# EAGLE schematic Sequencer - 8 Step - Cigar Box (EAGLE 6.6.0)

## Sheet 1 of 9: Power
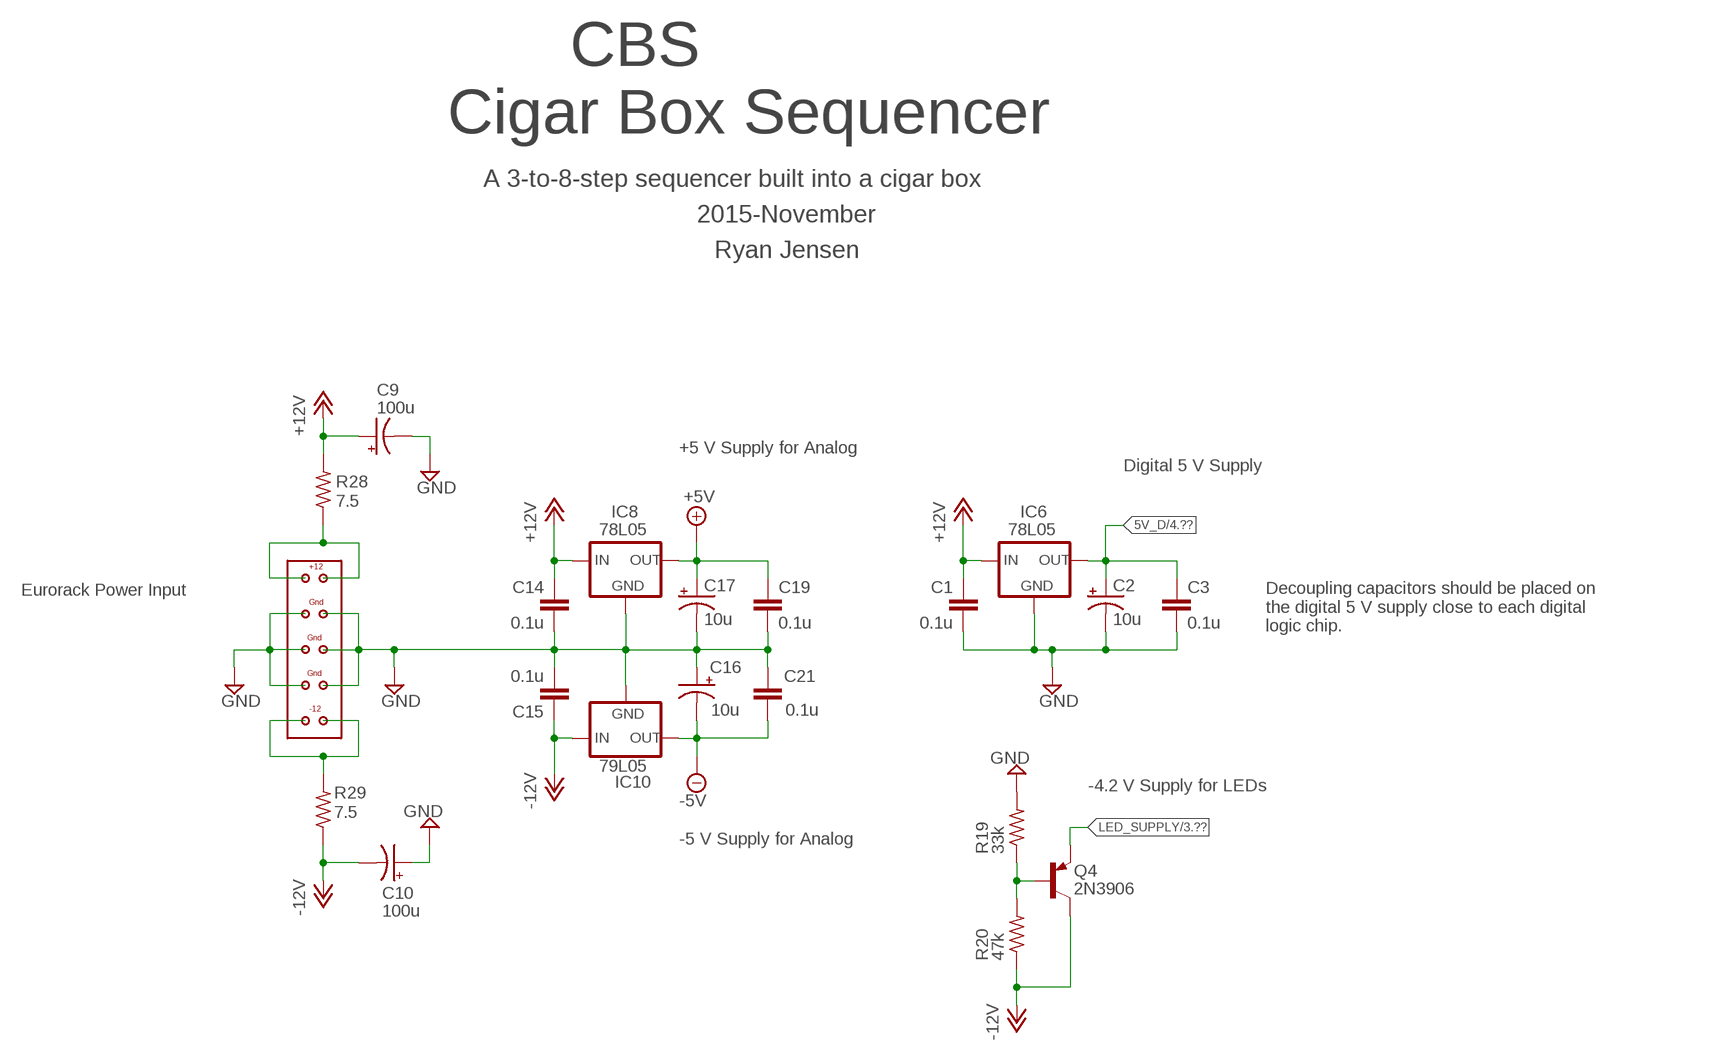
[diagram p0: schematic, sheet 1]

### Parts
C1  0.1u  C-EU025-050X050  [C025-050X050]
C2  10u  CPOL-USE3.5-10  [E3,5-10]
C3  0.1u  C-EU025-050X050  [C025-050X050]
C9  100u  CPOL-USE3.5-10  [E3,5-10]
C10  100u  CPOL-USE3.5-10  [E3,5-10]
C14  0.1u  C-EU025-050X050  [C025-050X050]
C15  0.1u  C-EU025-050X050  [C025-050X050]
C16  10u  CPOL-USE3.5-10  [E3,5-10]
C17  10u  CPOL-USE3.5-10  [E3,5-10]
C19  0.1u  C-EU025-050X050  [C025-050X050]
C21  0.1u  C-EU025-050X050  [C025-050X050]
IC6  78L05  78LXX  [78LXX]
IC8  78L05  78LXX  [78LXX]
IC10  79L05  79LXX  [79LXX]
Q4  2N3906  [TO92]
R19  33k  R-US_R0603  [R0603]
R20  47k  R-US_R0603  [R0603]
R28  7.5  R-US_0204/7  [0204/7]
R29  7.5  R-US_0204/7  [0204/7]
U$10  EURORACK-POWER  [EURORACK-POWER]

### Nets
5V_D: C2.+ C3.1 IC6.OUT ; also sheet 4,5,6
+5V: C17.+ C19.1 IC8.OUT ; also sheet 3,7
+12V: C1.1 C9.+ C14.1 IC6.IN IC8.IN R28.2 ; also sheet 2,7
-5V: C16.- C21.2 IC10.OUT ; also sheet 3,7
-12V: C10.- C15.1 IC10.IN Q4.1(C) R20.1 R29.1
GND: C1.2 C2.- C3.2 C9.- C10.+ C14.2 C15.2 C16.+ C17.- C19.2 C21.1 IC6.GND IC8.GND IC10.GND R19.2 U$10.P$3 U$10.P$4 U$10.P$5 U$10.P$6 U$10.P$7 U$10.P$8 ; also sheet 2,3,4,5,6,7,8,9
LED_SUPPLY: Q4.3(E) ; also sheet 3,8
N$36: R28.1 U$10.P$1 U$10.P$2
N$37: R29.2 U$10.P$9 U$10.P$10
N$41: Q4.2(B) R19.1 R20.2

### Notes on the sheet
- CBS
  Cigar Box Sequencer
- A 3-to-8-step sequencer built into a cigar box
- 2015-November
- Ryan Jensen
- +5 V Supply for Analog
- Digital 5 V Supply
- Eurorack Power Input
- Decoupling capacitors should be placed on
  the digital 5 V supply close to each digital
  logic chip.
- -4.2 V Supply for LEDs
- -5 V Supply for Analog

## Sheet 2 of 9: Rotary Switch 7-Segment LED control and reset signal routing
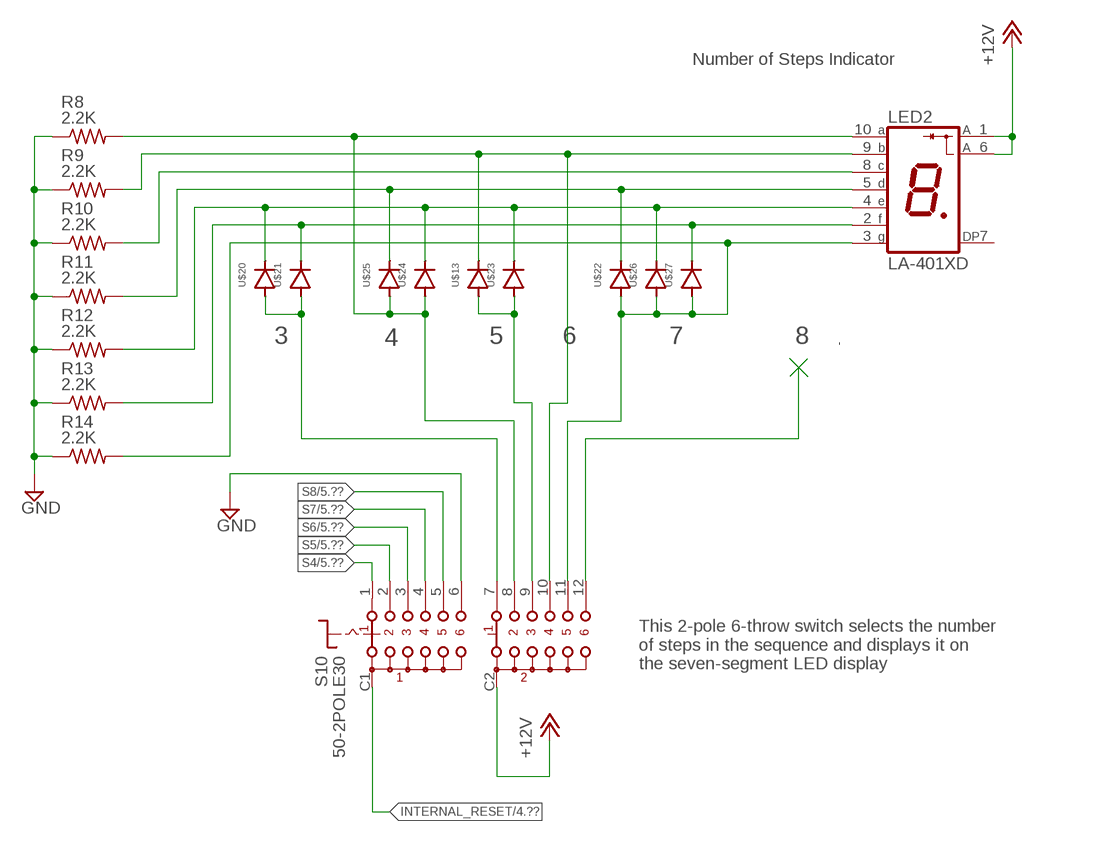
[diagram p1: schematic, sheet 2]

### Parts
LED2  LA-401XD  [LA-401]
R8  2.2K  R-US_R0603  [R0603]
R9  2.2K  R-US_R0603  [R0603]
R10  2.2K  R-US_R0603  [R0603]
R11  2.2K  R-US_R0603  [R0603]
R12  2.2K  R-US_R0603  [R0603]
R13  2.2K  R-US_R0603  [R0603]
R14  2.2K  R-US_R0603  [R0603]
S10  50-2POLE30  [50-2POLE30]
U$13  DIODE-0204/5  [DIODE-0204/5]
U$20  DIODE-0204/5  [DIODE-0204/5]
U$21  DIODE-0204/5  [DIODE-0204/5]
U$22  DIODE-0204/5  [DIODE-0204/5]
U$23  DIODE-0204/5  [DIODE-0204/5]
U$24  DIODE-0204/5  [DIODE-0204/5]
U$25  DIODE-0204/5  [DIODE-0204/5]
U$26  DIODE-0204/5  [DIODE-0204/5]
U$27  DIODE-0204/5  [DIODE-0204/5]

### Nets
+12V: LED2.1(A) LED2.6(A) S10.C2(S2) ; also sheet 1,7
GND: R8.1 R9.1 R10.1 R11.1 R12.1 R13.1 R14.1 S10.6 ; also sheet 1,3,4,5,6,7,8,9
INTERNAL_RESET: S10.C1(S1) ; also sheet 4
N$13: LED2.9(B) R9.2 S10.10 U$13.CATHODE
N$14: LED2.8(C) R10.2
N$15: LED2.5(D) R11.2 U$22.CATHODE U$25.CATHODE
N$16: LED2.4(E) R12.2 U$20.CATHODE U$23.CATHODE U$24.CATHODE U$26.CATHODE
N$17: LED2.2(F) R13.2 U$21.CATHODE U$27.CATHODE
N$18: S10.7 U$20.ANODE U$21.ANODE
N$19: LED2.10(A) R8.2 S10.8 U$24.ANODE U$25.ANODE
N$20: S10.9 U$13.ANODE U$23.ANODE
N$21: LED2.3(G) R14.2 S10.11 U$22.ANODE U$26.ANODE U$27.ANODE
N$22: S10.12
S4: S10.1 ; also sheet 5,7,9
S5: S10.2 ; also sheet 5,7,9
S6: S10.3 ; also sheet 5,7,9
S7: S10.4 ; also sheet 5,7,9
S8: S10.5 ; also sheet 5,7,9
Unconnected: LED2.7(DP)

### Notes on the sheet
- Number of Steps Indicator
- 3 | 4 | 5 | 6 | 7 | 8
- This 2-pole 6-throw switch selects the number
  of steps in the sequence and displays it on
  the seven-segment LED display

## Sheet 3 of 9: Clock Internal VCO, External Clock, Clock Combination
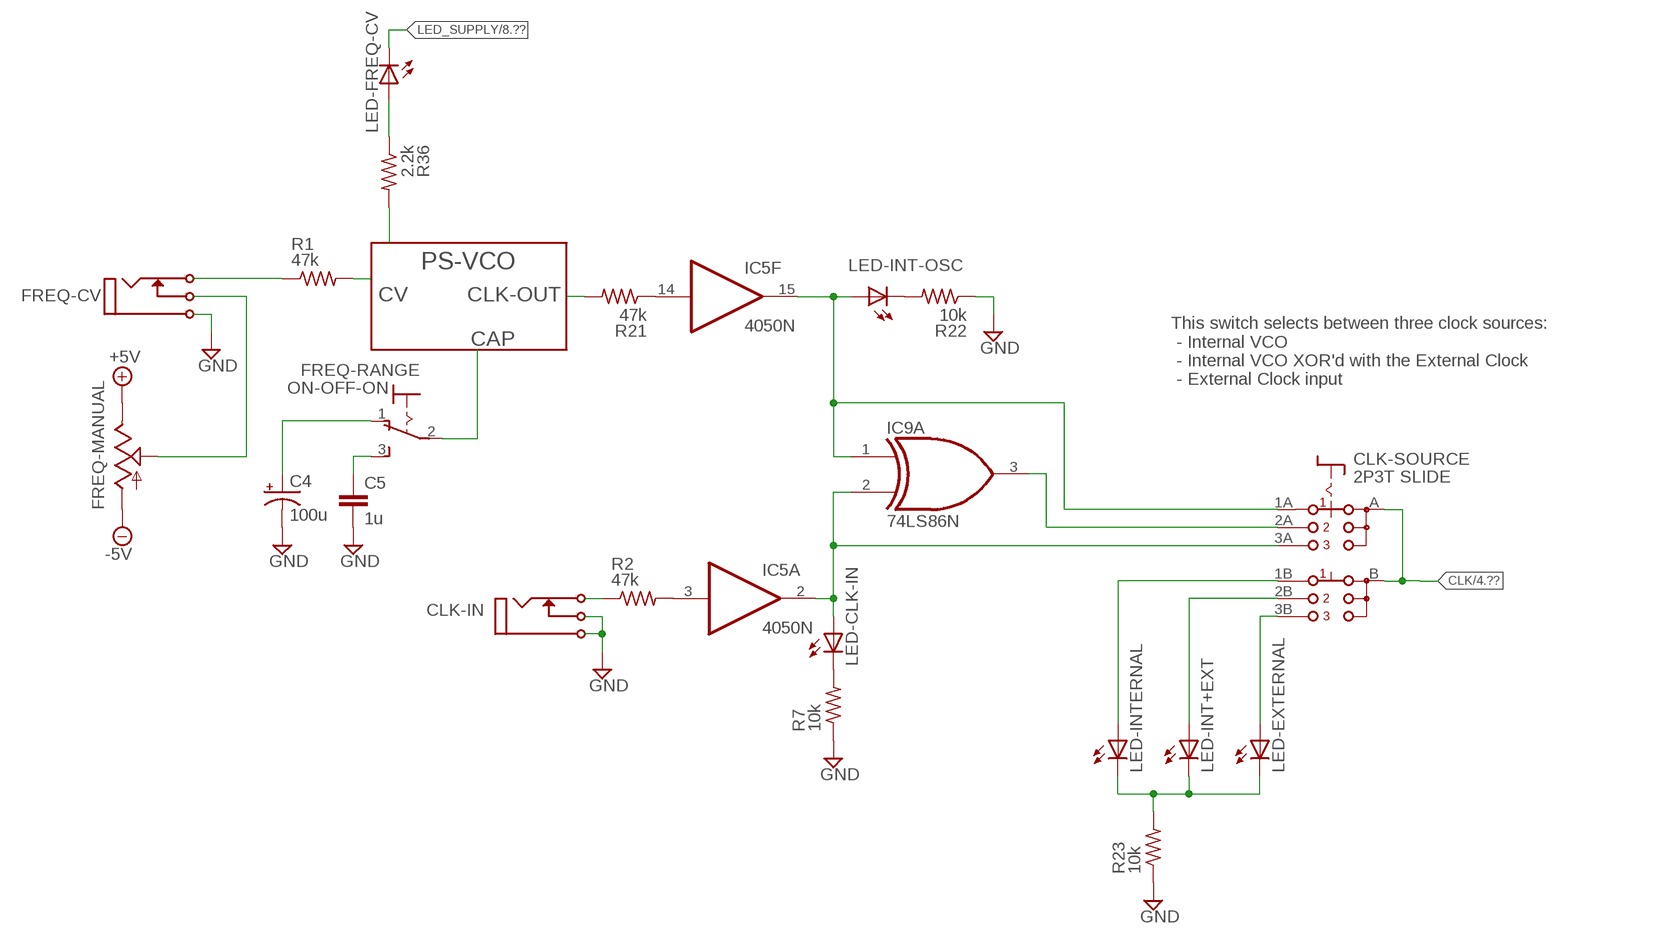
[diagram p2: schematic, sheet 3]

### Parts
C4  100u  CPOL-USE3.5-10  [E3,5-10]
C5  1u  C-EU025-050X050  [C025-050X050]
CLK-IN  I/O  MONO_JACK  [MONO_JACK]
CLK-SOURCE  2P3T SLIDE  ELMA-01-2X3  [ELMA-01-2X3]
FREQ-CV  I/O  MONO_JACK  [MONO_JACK]
FREQ-MANUAL  TRIM_US-B64Y  [B64Y]
FREQ-RANGE  ON-OFF-ON  320-916  [320-916]
IC5  4050N  [DIL16]
IC9  74LS86N  [DIL14]
LED-CLK-IN  TLLG4400  [LED3MM]
LED-EXTERNAL  TLLG4400  [LED3MM]
LED-FREQ-CV  TLLG4400  [LED3MM]
LED-INT+EXT  TLLG4400  [LED3MM]
LED-INT-OSC  TLLG4400  [LED3MM]
LED-INTERNAL  TLLG4400  [LED3MM]
R1  47k  R-US_R0603  [R0603]
R2  47k  R-US_R0603  [R0603]
R7  10k  R-US_R0603  [R0603]
R21  47k  R-US_R0603  [R0603]
R22  10k  R-US_R0603  [R0603]
R23  10k  R-US_R0603  [R0603]
R36  2.2k  R-US_R0603  [R0603]

### Nets
+5V: FREQ-MANUAL.E ; also sheet 1,7
-5V: FREQ-MANUAL.A ; also sheet 1,7
GND: C4.- C5.2 CLK-IN.P$1 CLK-IN.P$3(P3) FREQ-CV.P$1 R7.1 R22.1 R23.1 ; also sheet 1,2,4,5,6,7,8,9
LED_SUPPLY: LED-FREQ-CV.K(C) ; also sheet 1,8
N$1: R36.2
N$2: FREQ-CV.P$2(P2) R1.1
N$3: R1.2
N$4: IC5.3(A:I) R2.2
N$5: FREQ-CV.P$3(P3) FREQ-MANUAL.S
N$25: CLK-SOURCE.3A(A3) IC5.2(A:O) IC9.2(A:I1) LED-CLK-IN.A
N$26: CLK-IN.P$2(P2) R2.1
N$31: LED-CLK-IN.K(C) R7.2
N$38: FREQ-RANGE.2(P)
N$39: C5.1 FREQ-RANGE.3(S)
N$40: C4.+ FREQ-RANGE.1(O)
N$43: IC5.14(F:I) R21.1
N$44: LED-INT-OSC.K(C) R22.2
N$45: CLK-SOURCE.1A(A1) IC5.15(F:O) IC9.1(A:I0) LED-INT-OSC.A
N$46: CLK-SOURCE.A CLK-SOURCE.B
N$48: CLK-SOURCE.3B(B3) LED-EXTERNAL.A
N$49: CLK-SOURCE.2B(B2) LED-INT+EXT.A
N$50: CLK-SOURCE.1B(B1) LED-INTERNAL.A
N$51: LED-EXTERNAL.K(C) LED-INT+EXT.K(C) LED-INTERNAL.K(C) R23.2
N$54: R21.2
N$57: LED-FREQ-CV.A R36.1
N$70: CLK-SOURCE.2A(A2) IC9.3(A:O)
Unconnected: IC9.8(C:O) IC9.9(C:I0) IC9.10(C:I1)

### Notes on the sheet
- PS-VCO
- CV | CLK-OUT
- CAP
- This switch selects between three clock sources:
   - Internal VCO 
   - Internal VCO XOR'd with the External Clock
   - External Clock input

## Sheet 4 of 9: Binary Counter This part of the circuit contains the binary counter, along with the binary inputs and outputs.
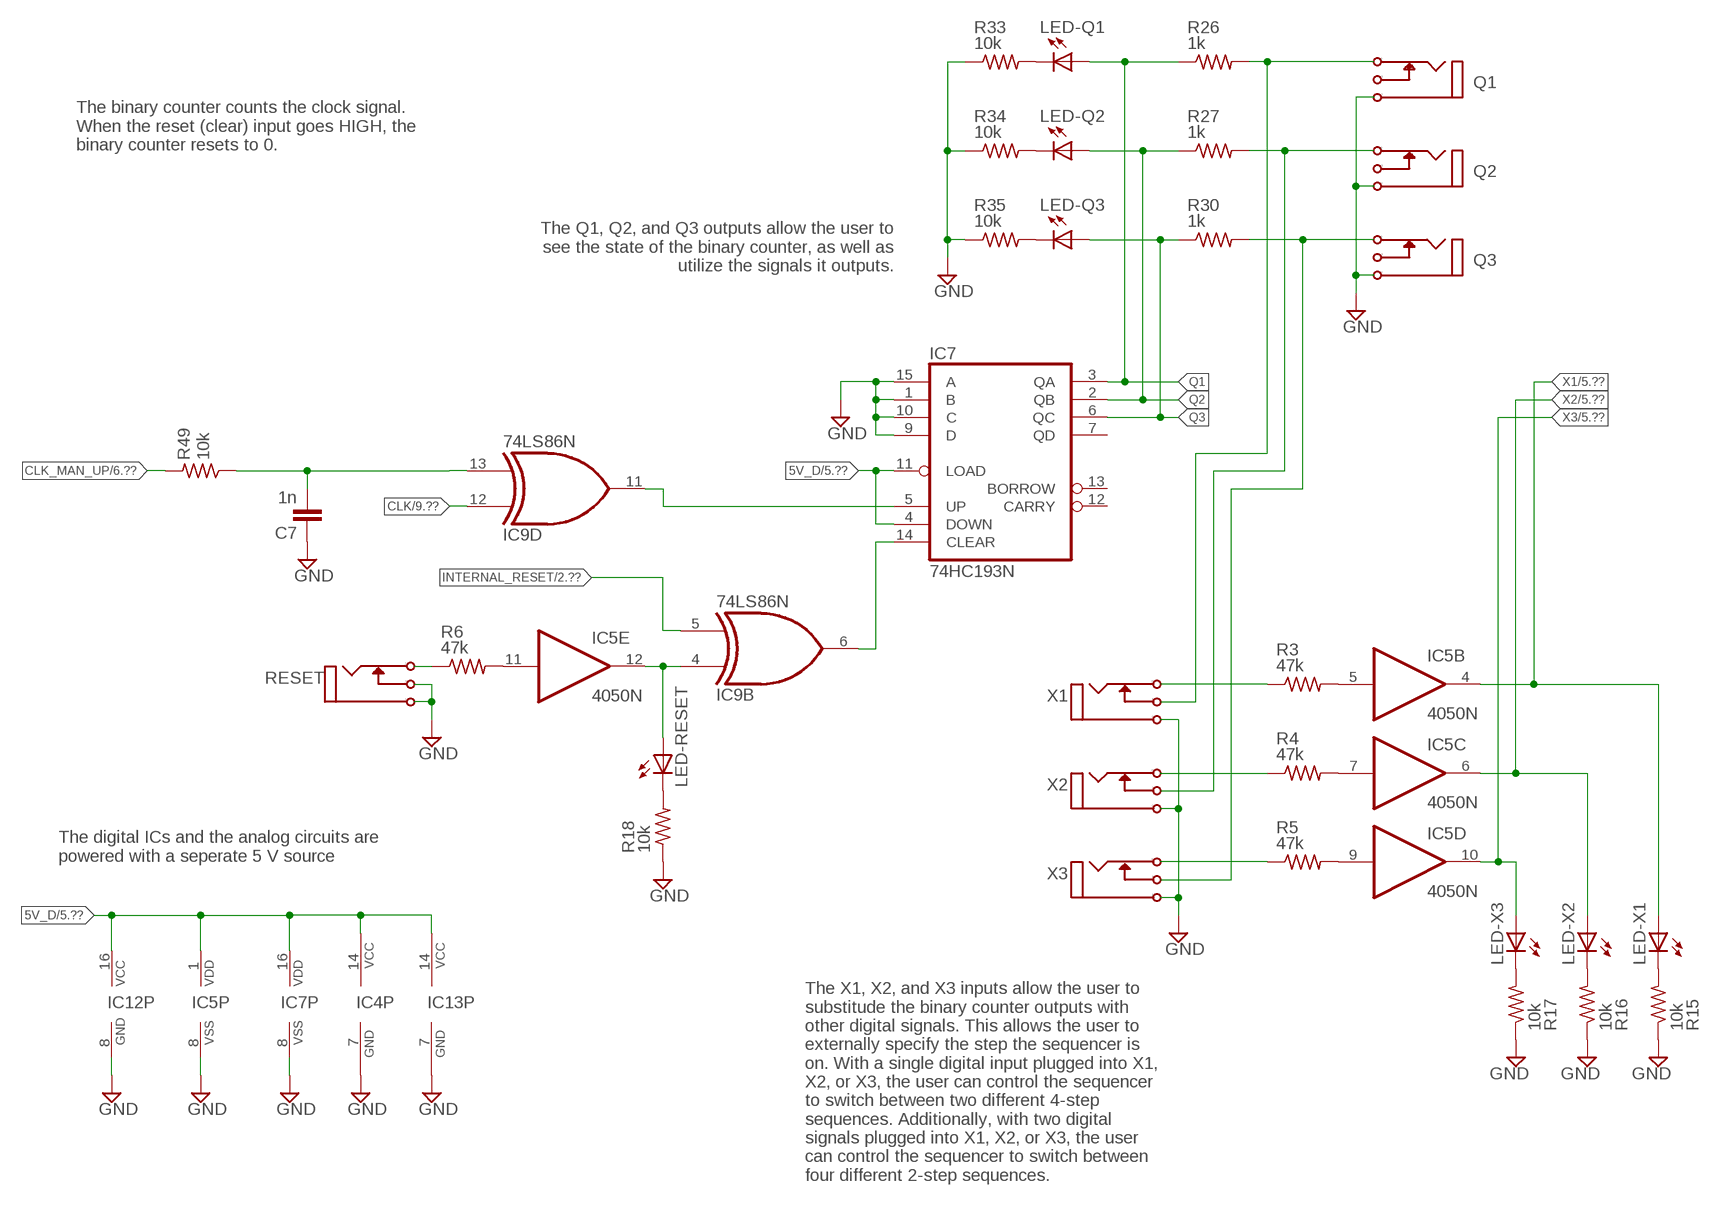
[diagram p3: schematic, sheet 4]

### Parts
C7  1n  C-EU025-050X050  [C025-050X050]
IC4  74ALS04N  [DIL14]
IC7  74HC193N  40193N  [DIL16]
IC12  74AC138N  [DIL16]
IC13  74ALS04N  [DIL14]
LED-Q1  TLLG4400  [LED3MM]
LED-Q2  TLLG4400  [LED3MM]
LED-Q3  TLLG4400  [LED3MM]
LED-RESET  TLLG4400  [LED3MM]
LED-X1  TLLG4400  [LED3MM]
LED-X2  TLLG4400  [LED3MM]
LED-X3  TLLG4400  [LED3MM]
Q1  I/O  MONO_JACK  [MONO_JACK]
Q2  I/O  MONO_JACK  [MONO_JACK]
Q3  I/O  MONO_JACK  [MONO_JACK]
R3  47k  R-US_R0603  [R0603]
R4  47k  R-US_R0603  [R0603]
R5  47k  R-US_R0603  [R0603]
R6  47k  R-US_R0603  [R0603]
R15  10k  R-US_R0603  [R0603]
R16  10k  R-US_R0603  [R0603]
R17  10k  R-US_R0603  [R0603]
R18  10k  R-US_R0603  [R0603]
R26  1k  R-US_R0603  [R0603]
R27  1k  R-US_R0603  [R0603]
R30  1k  R-US_R0603  [R0603]
R33  10k  R-US_R0603  [R0603]
R34  10k  R-US_R0603  [R0603]
R35  10k  R-US_R0603  [R0603]
R49  10k  R-US_0204/7  [0204/7]
RESET  I/O  MONO_JACK  [MONO_JACK]
X1  I/O  MONO_JACK  [MONO_JACK]
X2  I/O  MONO_JACK  [MONO_JACK]
X3  I/O  MONO_JACK  [MONO_JACK]

### Nets
5V_D: IC4.14(P:VCC) IC5.1(P:VDD) IC7.4(DOWN) IC7.11(LOAD) IC7.16(VDD) IC12.16(VCC) IC13.14(P:VCC) ; also sheet 1,5,6
CLK: IC9.12(D:I0) ; also sheet 3,9
CLK_MAN_UP: R49.2 ; also sheet 6
CLK_MAN_UP_FLT: IC9.13(D:I1)
GND: C7.1 IC4.7(P:GND) IC5.8(P:VSS) IC7.1(B) IC7.8(VSS) IC7.9(D) IC7.10(C) IC7.15(A) IC12.8(GND) IC13.7(P:GND) Q1.P$1 Q2.P$1 Q3.P$1 R15.1 R16.1 R17.1 R18.1 R33.1 R34.1 R35.1 RESET.P$1 RESET.P$3(P3) X1.P$1 X2.P$1 X3.P$1 ; also sheet 1,2,3,5,6,7,8,9
INTERNAL_RESET: IC9.5(B:I1) ; also sheet 2
N$6: IC5.5(B:I) R3.2
N$7: IC5.7(C:I) R4.2
N$8: IC5.9(D:I) R5.2
N$9: IC5.11(E:I) R6.2
N$10: IC5.12(E:O) IC9.4(B:I0) LED-RESET.A
N$27: R3.1 X1.P$2(P2)
N$28: R4.1 X2.P$2(P2)
N$29: R5.1 X3.P$2(P2)
N$30: R6.1 RESET.P$2(P2)
N$32: LED-X1.K(C) R15.2
N$33: LED-X2.K(C) R16.2
N$34: LED-X3.K(C) R17.2
N$35: LED-RESET.K(C) R18.2
N$42: IC7.14(CLEAR) IC9.6(B:O)
N$52: Q1.P$2(P2) R26.2 X1.P$3(P3)
N$53: Q2.P$2(P2) R27.2 X2.P$3(P3)
N$55: IC7.5(UP) IC9.11(D:O)
N$62: LED-Q1.K(C) R33.2
N$63: LED-Q2.K(C) R34.2
N$64: LED-Q3.K(C) R35.2
N$74: C7.2 R49.1
N$123: Q3.P$2(P2) R30.2 X3.P$3(P3)
Q1: IC7.3(QA) LED-Q1.A R26.1
Q2: IC7.2(QB) LED-Q2.A R27.1
Q3: IC7.6(QC) LED-Q3.A R30.1
X1: IC5.4(B:O) LED-X1.A ; also sheet 5
X2: IC5.6(C:O) LED-X2.A ; also sheet 5
X3: IC5.10(D:O) LED-X3.A ; also sheet 5
Unconnected: IC4.1(A:I) IC4.2(A:O) IC4.3(B:I) IC4.4(B:O) IC4.5(C:I) IC4.6(C:O) IC4.8(D:O) IC4.9(D:I) IC4.10(E:O) IC4.11(E:I) IC4.12(F:O) IC4.13(F:I) IC7.7(QD) IC7.12(CARRY) IC7.13(BORROW) IC12.1(A) IC12.2(B) IC12.3(C) IC12.4(G2A) IC12.5(G2B) IC12.6(G1) IC12.7(Y7) IC12.9(Y6) IC12.10(Y5) IC12.11(Y4) IC12.12(Y3) IC12.13(Y2) IC12.14(Y1) IC12.15(Y0) IC13.1(A:I) IC13.2(A:O) IC13.3(B:I) IC13.4(B:O) IC13.5(C:I) IC13.6(C:O) IC13.8(D:O) IC13.9(D:I) IC13.10(E:O) IC13.11(E:I) IC13.12(F:O) IC13.13(F:I) Q1.P$3(P3) Q2.P$3(P3) Q3.P$3(P3)

### Notes on the sheet
- The binary counter counts the clock signal.
  When the reset (clear) input goes HIGH, the
  binary counter resets to 0.
- The Q1, Q2, and Q3 outputs allow the user to
  see the state of the binary counter, as well as
  utilize the signals it outputs.
- The digital ICs and the analog circuits are
  powered with a seperate 5 V source
- The X1, X2, and X3 inputs allow the user to
  substitude the binary counter outputs with
  other digital signals. This allows the user to
  externally specify the step the sequencer is
  on. With a single digital input plugged into X1,
  X2, or X3, the user can control the sequencer
  to switch between two different 4-step
  sequences. Additionally, with two digital
  signals plugged into X1, X2, or X3, the user
  can control the sequencer to switch between
  four different 2-step sequences.

## Sheet 5 of 9: Demultiplexer This converts the three binary lines into eight steps.
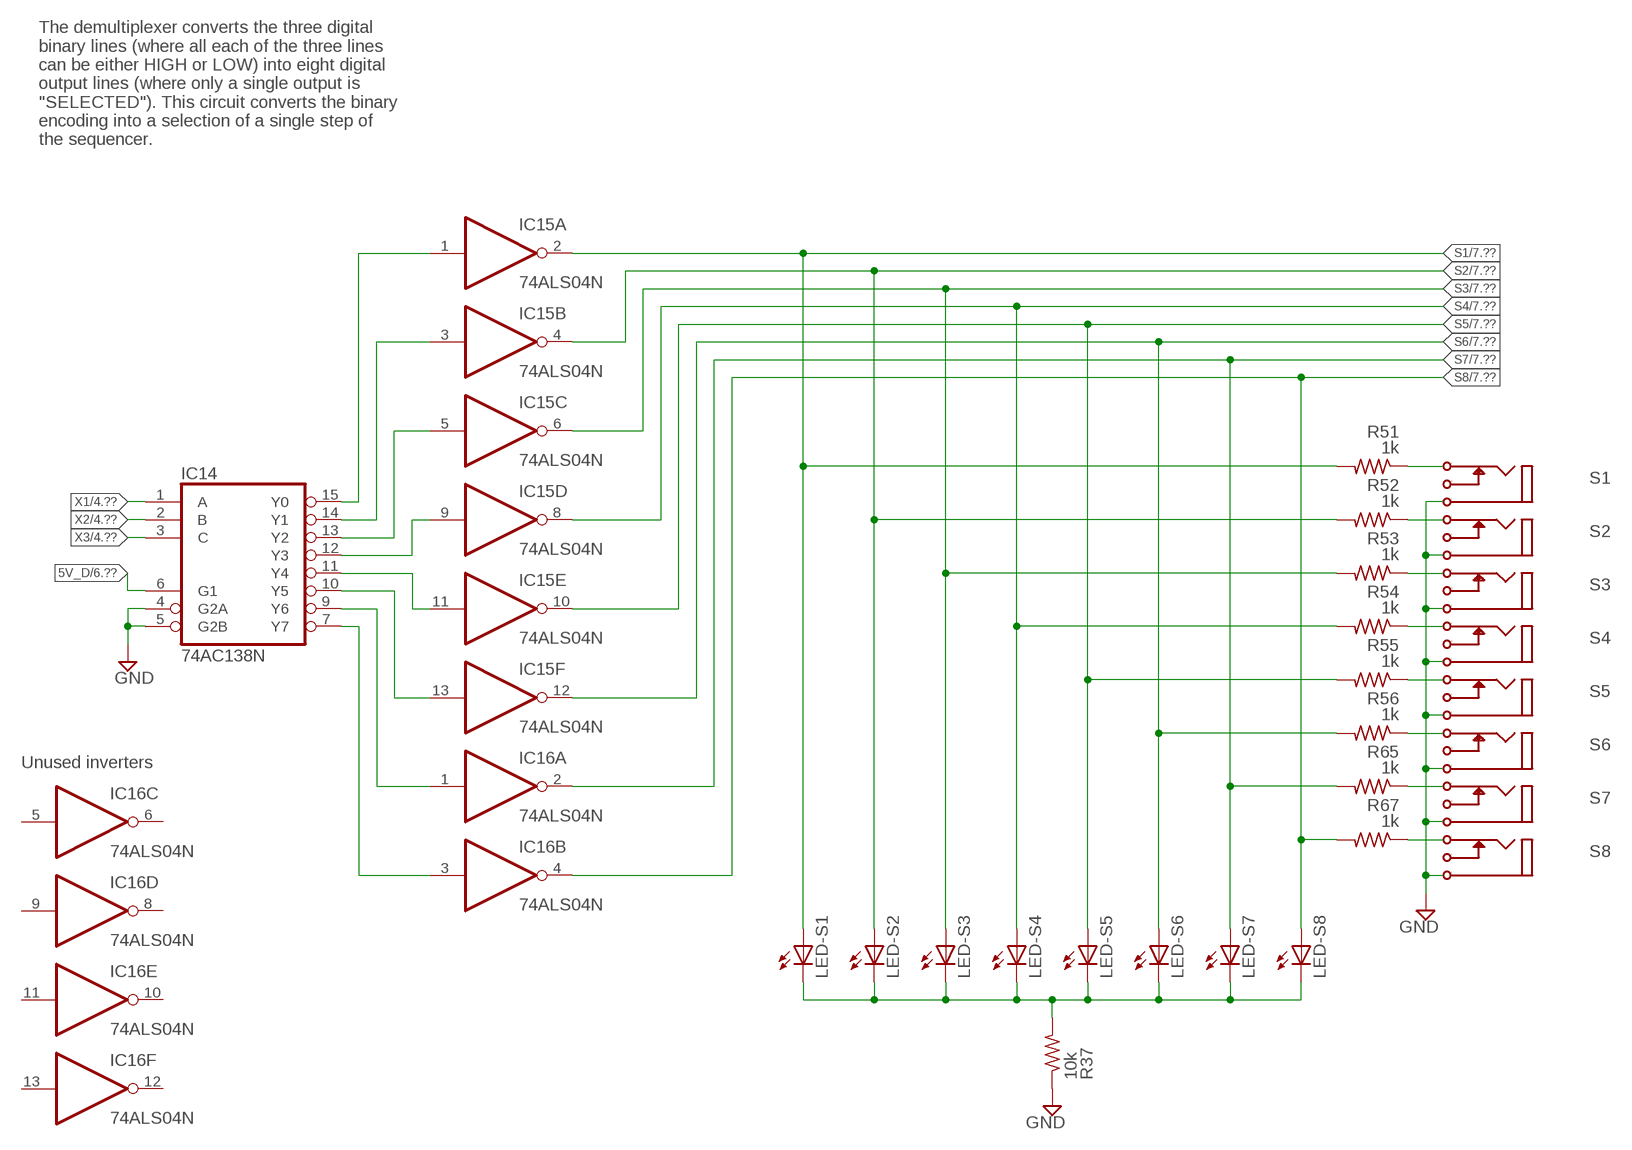
[diagram p4: schematic, sheet 5]

### Parts
IC14  74AC138N  [DIL16]
IC15  74ALS04N  [DIL14]
IC16  74ALS04N  [DIL14]
LED-S1  TLLG4400  [LED3MM]
LED-S2  TLLG4400  [LED3MM]
LED-S3  TLLG4400  [LED3MM]
LED-S4  TLLG4400  [LED3MM]
LED-S5  TLLG4400  [LED3MM]
LED-S6  TLLG4400  [LED3MM]
LED-S7  TLLG4400  [LED3MM]
LED-S8  TLLG4400  [LED3MM]
R37  10k  R-US_R0603  [R0603]
R51  1k  R-US_R0603  [R0603]
R52  1k  R-US_R0603  [R0603]
R53  1k  R-US_R0603  [R0603]
R54  1k  R-US_R0603  [R0603]
R55  1k  R-US_R0603  [R0603]
R56  1k  R-US_R0603  [R0603]
R65  1k  R-US_R0603  [R0603]
R67  1k  R-US_R0603  [R0603]
S1  I/O  MONO_JACK  [MONO_JACK]
S2  I/O  MONO_JACK  [MONO_JACK]
S3  I/O  MONO_JACK  [MONO_JACK]
S4  I/O  MONO_JACK  [MONO_JACK]
S5  I/O  MONO_JACK  [MONO_JACK]
S6  I/O  MONO_JACK  [MONO_JACK]
S7  I/O  MONO_JACK  [MONO_JACK]
S8  I/O  MONO_JACK  [MONO_JACK]

### Nets
5V_D: IC14.6(G1) ; also sheet 1,4,6
GND: IC14.4(G2A) IC14.5(G2B) R37.1 S1.P$1 S2.P$1 S3.P$1 S4.P$1 S5.P$1 S6.P$1 S7.P$1 S8.P$1 ; also sheet 1,2,3,4,6,7,8,9
N$58: IC14.12(Y3) IC15.9(D:I)
N$59: IC14.11(Y4) IC15.11(E:I)
N$60: IC14.13(Y2) IC15.5(C:I)
N$65: IC14.14(Y1) IC15.3(B:I)
N$66: IC14.15(Y0) IC15.1(A:I)
N$67: IC14.10(Y5) IC15.13(F:I)
N$68: IC14.9(Y6) IC16.1(A:I)
N$69: IC14.7(Y7) IC16.3(B:I)
N$71: LED-S1.K(C) LED-S2.K(C) LED-S3.K(C) LED-S4.K(C) LED-S5.K(C) LED-S6.K(C) LED-S7.K(C) LED-S8.K(C) R37.2
N$113: R51.1 S1.P$2(P2)
N$114: R52.1 S2.P$2(P2)
N$117: R53.1 S3.P$2(P2)
N$118: R54.1 S4.P$2(P2)
N$119: R55.1 S5.P$2(P2)
N$120: R56.1 S6.P$2(P2)
N$121: R65.1 S7.P$2(P2)
N$122: R67.1 S8.P$2(P2)
S1: IC15.2(A:O) LED-S1.A R51.2 ; also sheet 7,9
S2: IC15.4(B:O) LED-S2.A R52.2 ; also sheet 7,9
S3: IC15.6(C:O) LED-S3.A R53.2 ; also sheet 7,9
S4: IC15.8(D:O) LED-S4.A R54.2 ; also sheet 2,7,9
S5: IC15.10(E:O) LED-S5.A R55.2 ; also sheet 2,7,9
S6: IC15.12(F:O) LED-S6.A R56.2 ; also sheet 2,7,9
S7: IC16.2(A:O) LED-S7.A R65.2 ; also sheet 2,7,9
S8: IC16.4(B:O) LED-S8.A R67.2 ; also sheet 2,7,9
X1: IC14.1(A) ; also sheet 4
X2: IC14.2(B) ; also sheet 4
X3: IC14.3(C) ; also sheet 4
Unconnected: IC16.5(C:I) IC16.6(C:O) IC16.8(D:O) IC16.9(D:I) IC16.10(E:O) IC16.11(E:I) IC16.12(F:O) IC16.13(F:I) S1.P$3(P3) S2.P$3(P3) S3.P$3(P3) S4.P$3(P3) S5.P$3(P3) S6.P$3(P3) S7.P$3(P3) S8.P$3(P3)

### Notes on the sheet
- The demultiplexer converts the three digital
  binary lines (where all each of the three lines
  can be either HIGH or LOW) into eight digital
  output lines (where only a single output is
  "SELECTED"). This circuit converts the binary
  encoding into a selection of a single step of
  the sequencer.
- Unused inverters

## Sheet 6 of 9: Manual Step Advance
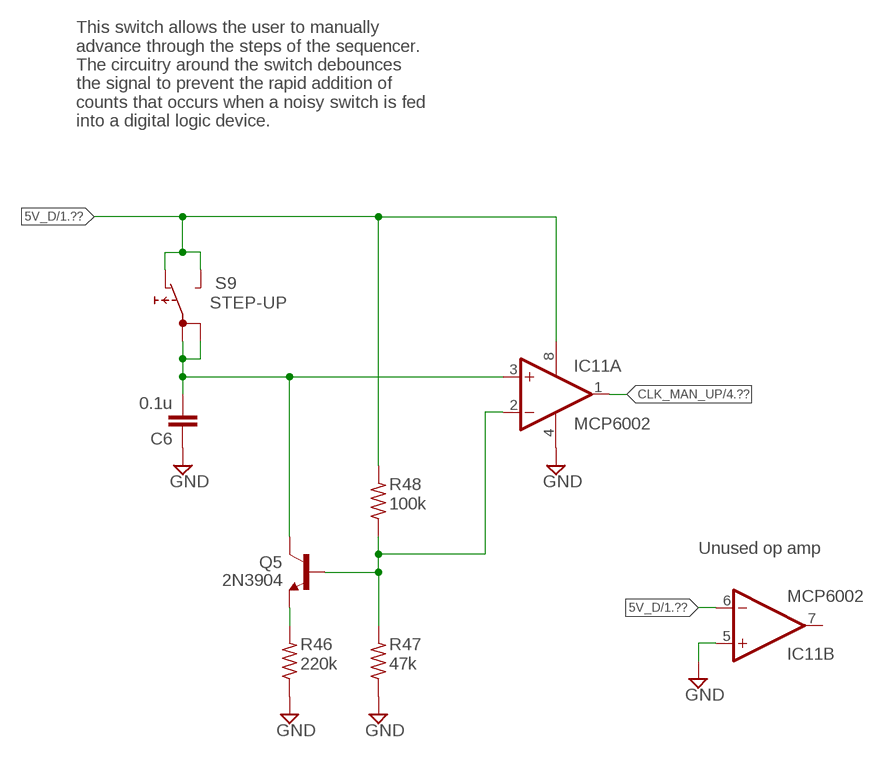
[diagram p5: schematic, sheet 6]

### Parts
C6  0.1u  C-EU025-050X050  [C025-050X050]
IC11  MCP6002  MCP602P  [DIL08]
Q5  2N3904  [TO92]
R46  220k  R-US_0204/7  [0204/7]
R47  47k  R-US_0204/7  [0204/7]
R48  100k  R-US_0204/7  [0204/7]
S9  STEP-UP  5501  [5501]

### Nets
5V_D: IC11.6(B:-IN) IC11.8(P:V+) R48.2 S9.NC S9.NO ; also sheet 1,4,5
CLK_MAN_UP: IC11.1(A:OUT) ; also sheet 4
GND: C6.1 IC11.4(P:V-) IC11.5(B:+IN) R46.1 R47.1 ; also sheet 1,2,3,4,5,7,8,9
N$47: C6.2 IC11.3(A:+IN) Q5.1(C) S9.1A S9.1B
N$72: Q5.3(E) R46.2
N$75: IC11.2(A:-IN) Q5.2(B) R47.2 R48.1
Unconnected: IC11.7(B:OUT)

### Notes on the sheet
- This switch allows the user to manually
  advance through the steps of the sequencer.
  The circuitry around the switch debounces
  the signal to prevent the rapid addition of
  counts that occurs when a noisy switch is fed
  into a digital logic device.
- Unused op amp

## Sheet 7 of 9: Voltage Selector This part of the circuit inputs the 8 demux lines and selects the corresponding potentiometer voltage to buffer.
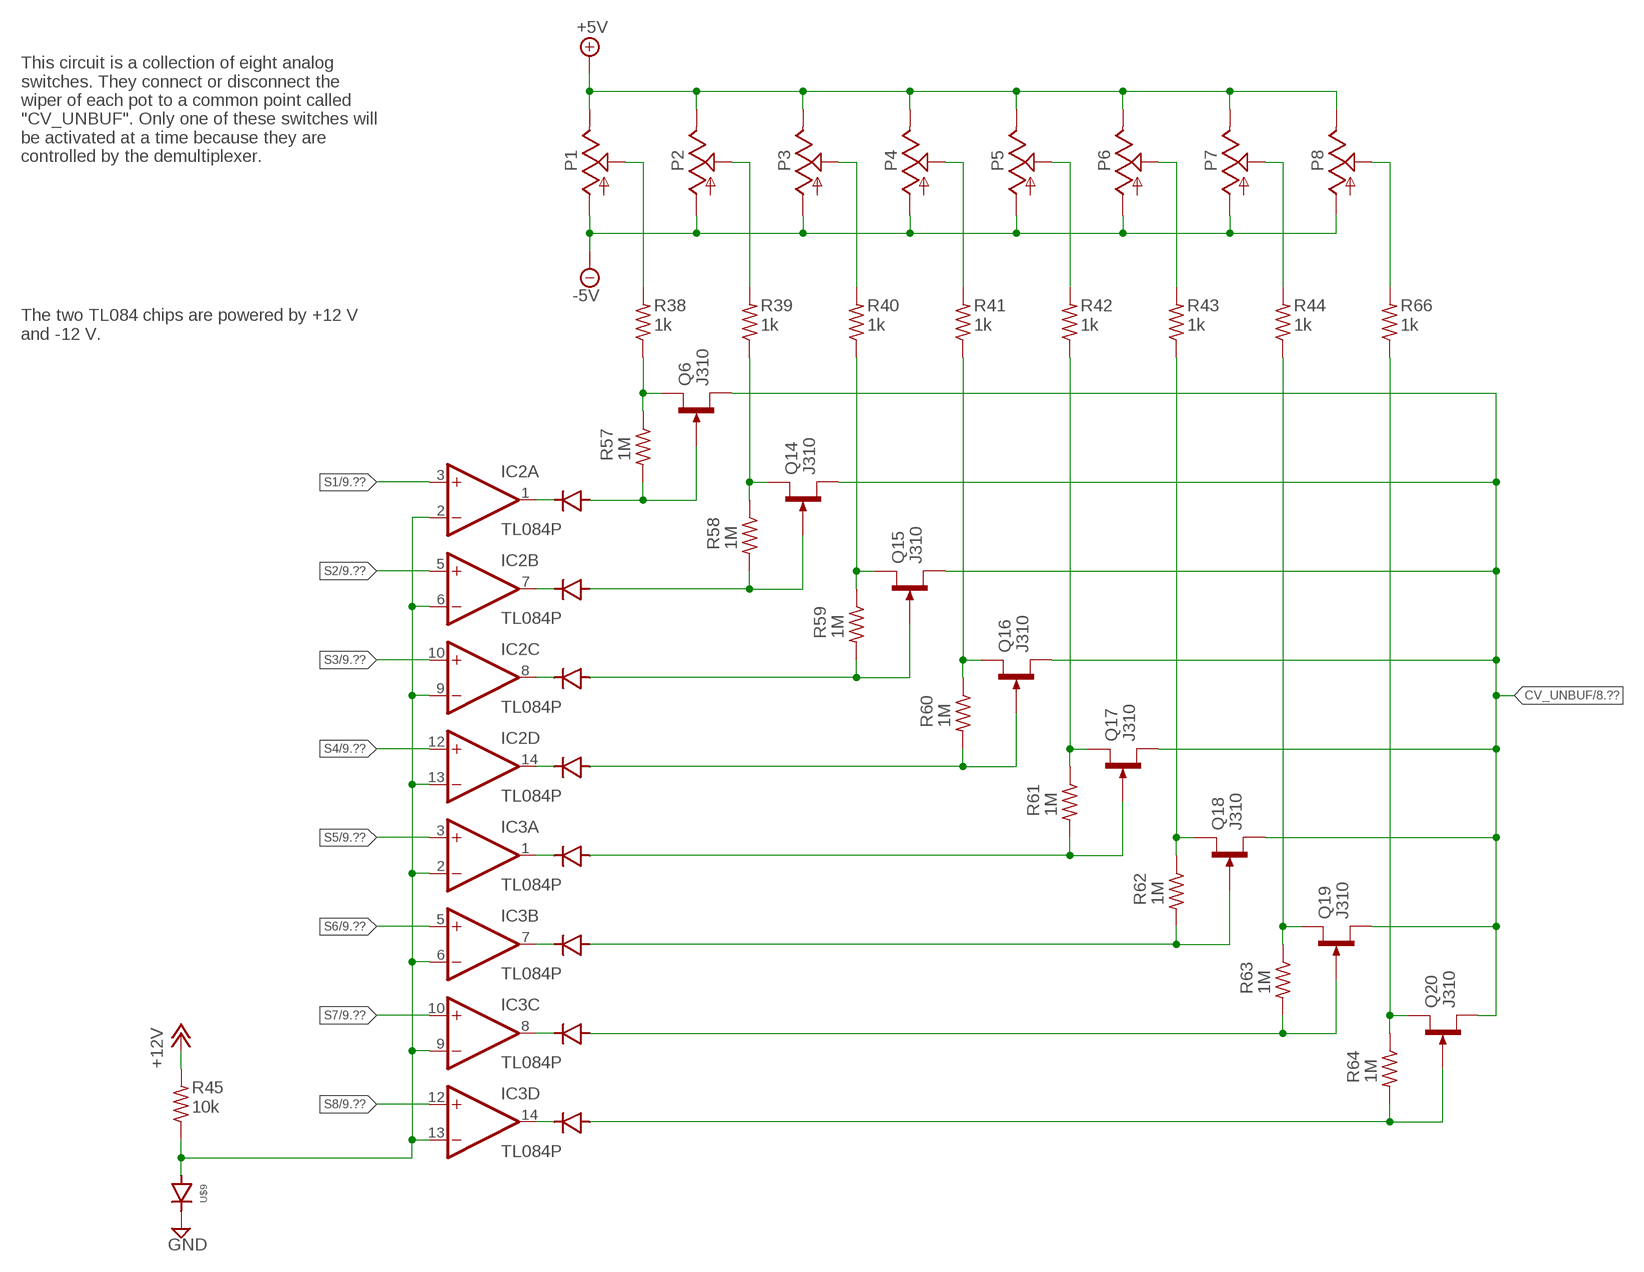
[diagram p6: schematic, sheet 7]

### Parts
IC2  TL084P  [DIL14]
IC3  TL084P  [DIL14]
P1  TRIM_US-B64Y  [B64Y]
P2  TRIM_US-B64Y  [B64Y]
P3  TRIM_US-B64Y  [B64Y]
P4  TRIM_US-B64Y  [B64Y]
P5  TRIM_US-B64Y  [B64Y]
P6  TRIM_US-B64Y  [B64Y]
P7  TRIM_US-B64Y  [B64Y]
P8  TRIM_US-B64Y  [B64Y]
Q6  J310  [TO92R]
Q14  J310  [TO92R]
Q15  J310  [TO92R]
Q16  J310  [TO92R]
Q17  J310  [TO92R]
Q18  J310  [TO92R]
Q19  J310  [TO92R]
Q20  J310  [TO92R]
R38  1k  R-US_0204/7  [0204/7]
R39  1k  R-US_0204/7  [0204/7]
R40  1k  R-US_0204/7  [0204/7]
R41  1k  R-US_0204/7  [0204/7]
R42  1k  R-US_0204/7  [0204/7]
R43  1k  R-US_0204/7  [0204/7]
R44  1k  R-US_0204/7  [0204/7]
R45  10k  R-US_0204/7  [0204/7]
R57  1M  R-US_0204/7  [0204/7]
R58  1M  R-US_0204/7  [0204/7]
R59  1M  R-US_0204/7  [0204/7]
R60  1M  R-US_0204/7  [0204/7]
R61  1M  R-US_0204/7  [0204/7]
R62  1M  R-US_0204/7  [0204/7]
R63  1M  R-US_0204/7  [0204/7]
R64  1M  R-US_0204/7  [0204/7]
R66  1k  R-US_0204/7  [0204/7]
U$1  DIODE-0204/5  [DIODE-0204/5]
U$2  DIODE-0204/5  [DIODE-0204/5]
U$3  DIODE-0204/5  [DIODE-0204/5]
U$4  DIODE-0204/5  [DIODE-0204/5]
U$5  DIODE-0204/5  [DIODE-0204/5]
U$6  DIODE-0204/5  [DIODE-0204/5]
U$7  DIODE-0204/5  [DIODE-0204/5]
U$8  DIODE-0204/5  [DIODE-0204/5]
U$9  DIODE-0204/5  [DIODE-0204/5]

### Nets
+5V: P1.E P2.E P3.E P4.E P5.E P6.E P7.E P8.E ; also sheet 1,3
+12V: R45.2 ; also sheet 1,2
-5V: P1.A P2.A P3.A P4.A P5.A P6.A P7.A P8.A ; also sheet 1,3
CV_UNBUF: Q6.S Q14.S Q15.S Q16.S Q17.S Q18.S Q19.S Q20.S ; also sheet 8
GND: U$9.CATHODE ; also sheet 1,2,3,4,5,6,8,9
N$76: IC3.14(D:OUT) U$8.CATHODE
N$77: IC3.8(C:OUT) U$7.CATHODE
N$78: IC3.7(B:OUT) U$6.CATHODE
N$79: IC3.1(A:OUT) U$5.CATHODE
N$80: IC2.14(D:OUT) U$4.CATHODE
N$81: IC2.8(C:OUT) U$3.CATHODE
N$82: IC2.7(B:OUT) U$2.CATHODE
N$83: IC2.1(A:OUT) U$1.CATHODE
N$84: P1.S R38.2
N$85: P2.S R39.2
N$86: P3.S R40.2
N$87: P4.S R41.2
N$88: P5.S R42.2
N$89: P6.S R43.2
N$90: P7.S R44.2
N$91: P8.S R66.2
N$92: Q6.G R57.2 U$1.ANODE
N$93: Q6.D R38.1 R57.1
N$94: Q14.G R58.2 U$2.ANODE
N$95: Q14.D R39.1 R58.1
N$96: Q15.G R59.2 U$3.ANODE
N$97: Q15.D R40.1 R59.1
N$98: Q16.G R60.2 U$4.ANODE
N$99: Q16.D R41.1 R60.1
N$100: Q17.G R61.2 U$5.ANODE
N$101: Q17.D R42.1 R61.1
N$102: Q18.G R62.2 U$6.ANODE
N$103: Q18.D R43.1 R62.1
N$104: Q19.G R63.2 U$7.ANODE
N$105: Q19.D R44.1 R63.1
N$106: Q20.G R64.2 U$8.ANODE
N$107: Q20.D R64.1 R66.1
N$116: IC2.2(A:-IN) IC2.6(B:-IN) IC2.9(C:-IN) IC2.13(D:-IN) IC3.2(A:-IN) IC3.6(B:-IN) IC3.9(C:-IN) IC3.13(D:-IN) R45.1 U$9.ANODE
S1: IC2.3(A:+IN) ; also sheet 5,9
S2: IC2.5(B:+IN) ; also sheet 5,9
S3: IC2.10(C:+IN) ; also sheet 5,9
S4: IC2.12(D:+IN) ; also sheet 2,5,9
S5: IC3.3(A:+IN) ; also sheet 2,5,9
S6: IC3.5(B:+IN) ; also sheet 2,5,9
S7: IC3.10(C:+IN) ; also sheet 2,5,9
S8: IC3.12(D:+IN) ; also sheet 2,5,9

### Notes on the sheet
- This circuit is a collection of eight analog
  switches. They connect or disconnect the
  wiper of each pot to a common point called
  "CV_UNBUF". Only one of these switches will
  be activated at a time because they are
  controlled by the demultiplexer.
- The two TL084 chips are powered by +12 V
  and -12 V.

## Sheet 8 of 9: CV-OUT & Filtering This part of the circuit filters the output CV
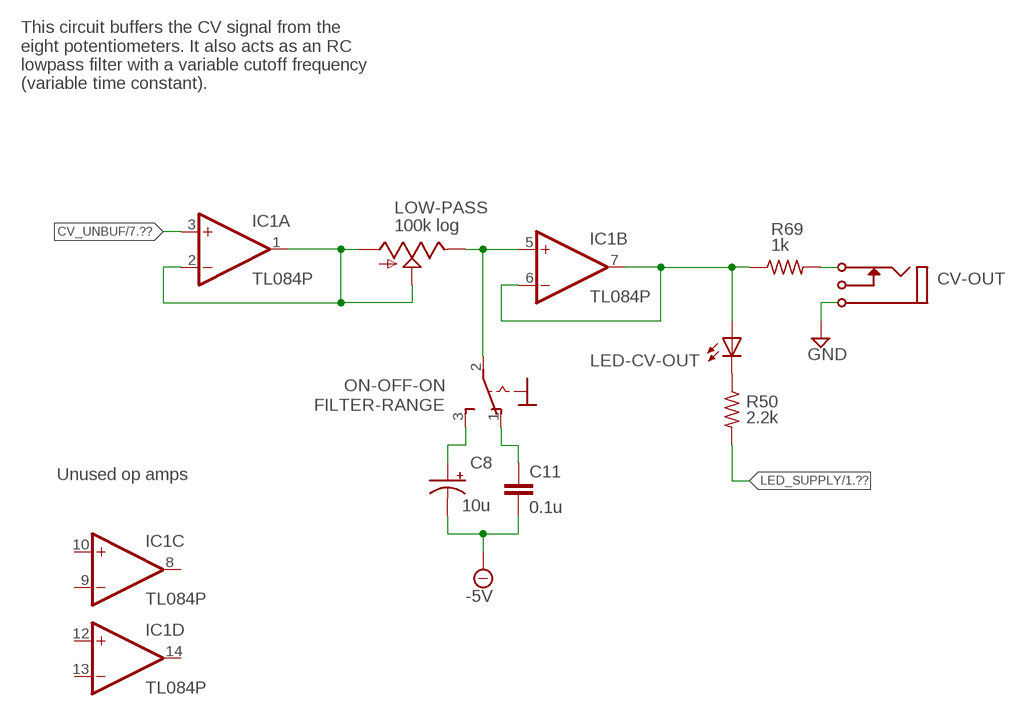
[diagram p7: schematic, sheet 8]

### Parts
C8  10u  CPOL-USE3.5-10  [E3,5-10]
C11  0.1u  C-EU025-050X050  [C025-050X050]
CV-OUT  I/O  MONO_JACK  [MONO_JACK]
FILTER-RANGE  ON-OFF-ON  320-916  [320-916]
IC1  TL084P  [DIL14]
LED-CV-OUT  TLLG4400  [LED3MM]
LOW-PASS  100k log  TRIM_US-B64Y  [B64Y]
R50  2.2k  R-US_R0603  [R0603]
R69  1k  R-US_R0603  [R0603]

### Nets
CV_UNBUF: IC1.3(A:+IN) ; also sheet 7
GND: CV-OUT.P$1 ; also sheet 1,2,3,4,5,6,7,9
LED_SUPPLY: R50.2 ; also sheet 1,3
N$73: IC1.1(A:OUT) IC1.2(A:-IN) LOW-PASS.A LOW-PASS.S
N$108: IC1.6(B:-IN) IC1.7(B:OUT) LED-CV-OUT.A R69.1
N$109: FILTER-RANGE.2(P) IC1.5(B:+IN) LOW-PASS.E
N$110: C11.1 FILTER-RANGE.1(O)
N$111: C8.- C11.2
N$112: C8.+ FILTER-RANGE.3(S)
N$115: LED-CV-OUT.K(C) R50.1
N$124: CV-OUT.P$2(P2) R69.2
Unconnected: CV-OUT.P$3(P3) IC1.8(C:OUT) IC1.9(C:-IN) IC1.10(C:+IN) IC1.12(D:+IN) IC1.13(D:-IN) IC1.14(D:OUT)

### Notes on the sheet
- This circuit buffers the CV signal from the
  eight potentiometers. It also acts as an RC
  lowpass filter with a variable cutoff frequency
  (variable time constant).
- Unused op amps

## Sheet 9 of 9
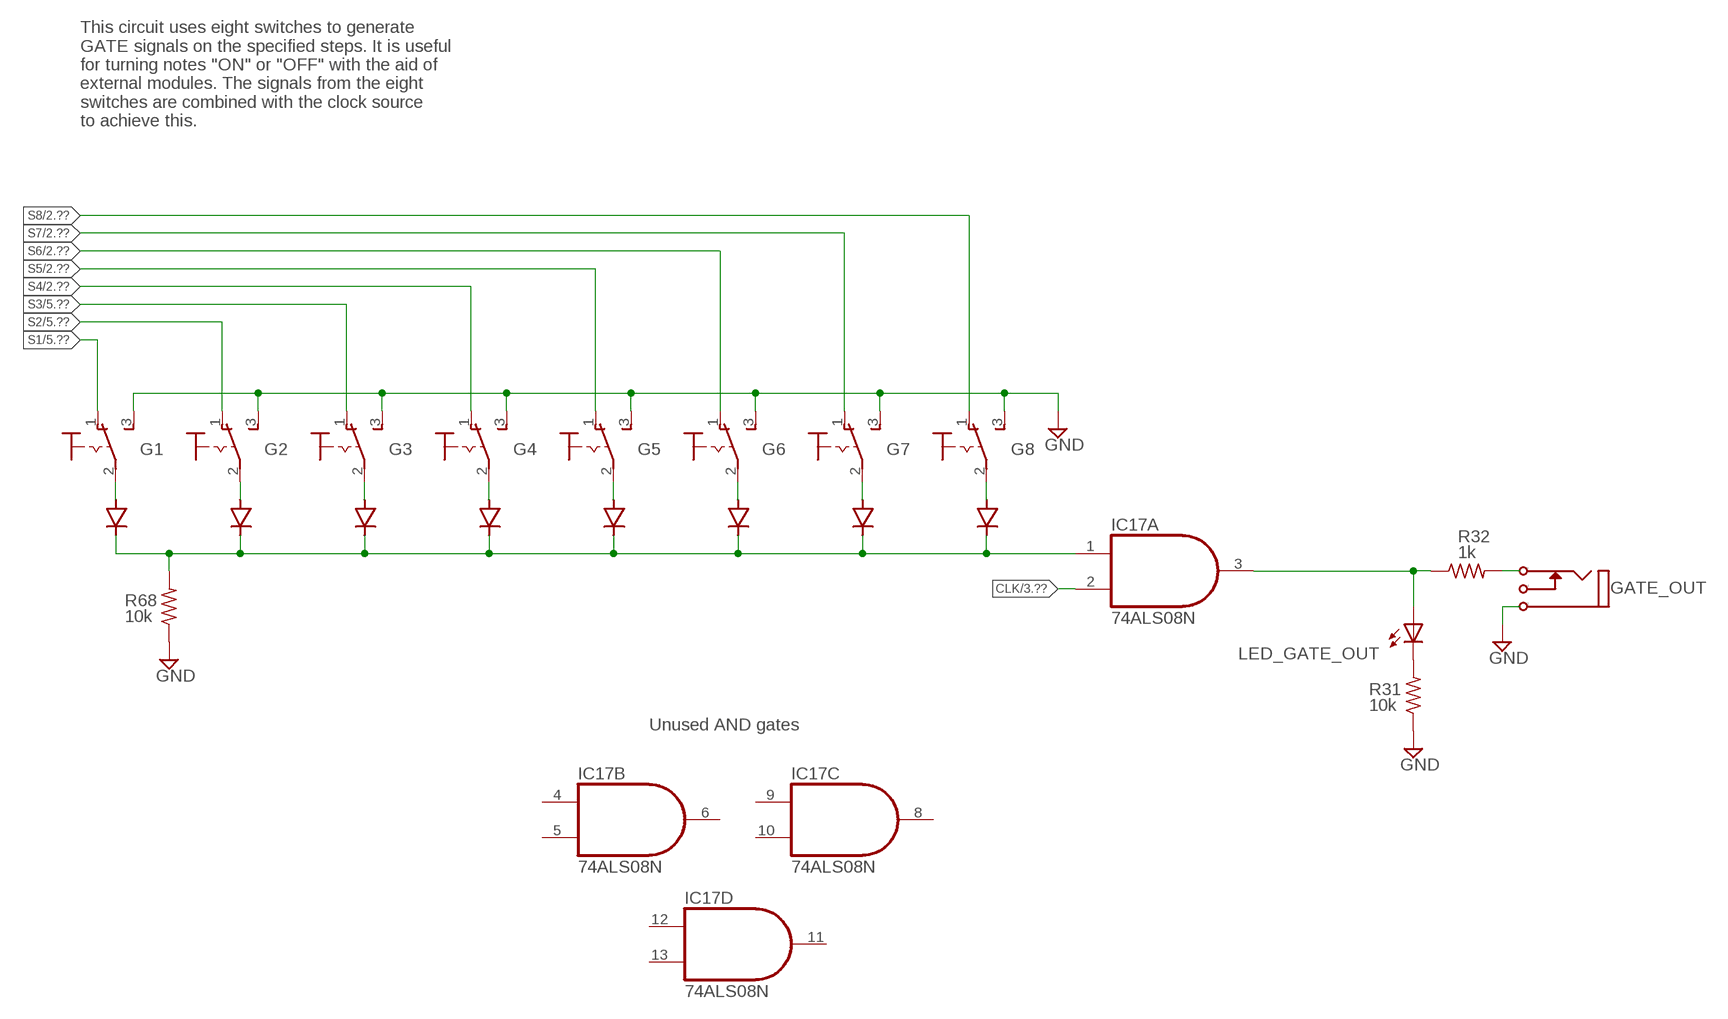
[diagram p8: schematic, sheet 9]

### Parts
G1  ON-OFF-ON  320-916  [320-916]
G2  ON-OFF-ON  320-916  [320-916]
G3  ON-OFF-ON  320-916  [320-916]
G4  ON-OFF-ON  320-916  [320-916]
G5  ON-OFF-ON  320-916  [320-916]
G6  ON-OFF-ON  320-916  [320-916]
G7  ON-OFF-ON  320-916  [320-916]
G8  ON-OFF-ON  320-916  [320-916]
GATE_OUT  I/O  MONO_JACK  [MONO_JACK]
IC17  74ALS08N  [DIL14]
LED_GATE_OUT  TLLG4400  [LED3MM]
R31  10k  R-US_R0603  [R0603]
R32  1k  R-US_R0603  [R0603]
R68  10k  R-US_R0603  [R0603]
U$11  DIODE-0204/5  [DIODE-0204/5]
U$12  DIODE-0204/5  [DIODE-0204/5]
U$14  DIODE-0204/5  [DIODE-0204/5]
U$15  DIODE-0204/5  [DIODE-0204/5]
U$16  DIODE-0204/5  [DIODE-0204/5]
U$17  DIODE-0204/5  [DIODE-0204/5]
U$18  DIODE-0204/5  [DIODE-0204/5]
U$19  DIODE-0204/5  [DIODE-0204/5]

### Nets
CLK: IC17.2(A:I1) ; also sheet 3,4
COMBINED-GATE-SIGNAL-AFAEVIRO: LED_GATE_OUT.A R32.1
GND: G1.3(S) G2.3(S) G3.3(S) G4.3(S) G5.3(S) G6.3(S) G7.3(S) G8.3(S) GATE_OUT.P$1 R31.1 R68.1 ; also sheet 1,2,3,4,5,6,7,8
N$56: GATE_OUT.P$2(P2) R32.2
N$61: LED_GATE_OUT.K(C) R31.2
N$126: G8.2(P) U$19.ANODE
N$127: G7.2(P) U$18.ANODE
N$128: G6.2(P) U$17.ANODE
N$129: G5.2(P) U$16.ANODE
N$130: G4.2(P) U$15.ANODE
N$131: G3.2(P) U$14.ANODE
N$132: G2.2(P) U$12.ANODE
N$133: G1.2(P) U$11.ANODE
N$141: IC17.1(A:I0) R68.2 U$11.CATHODE U$12.CATHODE U$14.CATHODE U$15.CATHODE U$16.CATHODE U$17.CATHODE U$18.CATHODE U$19.CATHODE
S1: G1.1(O) ; also sheet 5,7
S2: G2.1(O) ; also sheet 5,7
S3: G3.1(O) ; also sheet 5,7
S4: G4.1(O) ; also sheet 2,5,7
S5: G5.1(O) ; also sheet 2,5,7
S6: G6.1(O) ; also sheet 2,5,7
S7: G7.1(O) ; also sheet 2,5,7
S8: G8.1(O) ; also sheet 2,5,7
Unconnected: GATE_OUT.P$3(P3) IC17.3(A:O) IC17.4(B:I0) IC17.5(B:I1) IC17.6(B:O) IC17.8(C:O) IC17.9(C:I0) IC17.10(C:I1) IC17.11(D:O) IC17.12(D:I0) IC17.13(D:I1)

### Notes on the sheet
- This circuit uses eight switches to generate
  GATE signals on the specified steps. It is useful
  for turning notes "ON" or "OFF" with the aid of
  external modules. The signals from the eight
  switches are combined with the clock source
  to achieve this.
- Unused AND gates

## Power pins joined to a net without a drawn wire
GND: IC9.7(P:GND) IC14.8(GND) IC15.7(P:GND) IC16.7(P:GND) IC17.7(P:GND)
V+: IC1.4(P:V+) IC2.4(P:V+) IC3.4(P:V+)
V-: IC1.11(P:V-) IC2.11(P:V-) IC3.11(P:V-)
VCC: IC9.14(P:VCC) IC14.16(VCC) IC15.14(P:VCC) IC16.14(P:VCC) IC17.14(P:VCC)

## Library data of the parts
C1 C3 C5-C7 C11 C14 C15 C19 C21 = resistor:C-EU: CAPACITOR, European symbol
C2 C4 C8-C10 C16 C17 = rcl:CPOL-US: POLARIZED CAPACITOR, American symbol
CLK-IN CV-OUT FREQ-CV GATE_OUT Q1-Q3 RESET S1-S8 X1-X3 = !synth_sch:MONO_JACK
CLK-SOURCE = switch:ELMA-01-2X3: Rotary Switches Type 01 Source: http://www.elma.com/files/products/rotary_components/pdfs/rotary_switches_type_01_002.pdf
FILTER-RANGE FREQ-RANGE G1-G8 = switch:320-916: TOGGLE SWITCH distributor RS Components
FREQ-MANUAL LOW-PASS P1-P8 = pot:TRIM_US-: POTENTIOMETER
IC1-IC3 = linear:TL084: OP AMP
IC4 IC13 IC15 IC16 = 74xx-us:74*04: Hex INVERTER
IC5 = 40xx:4050: Hex non-inverting BUFFER
IC6 IC8 = v-reg:78LXX: VOLTAGE REGULATOR
IC7 = 40xx:40193: Binary up down COUNTER
IC9 = 74xx-us:74*86: Quad 2-input EXCLUSIV-OR (XOR) gate
IC10 = v-reg:79LXX: VOLTAGE REGULATOR
IC11 = linear:MCP602: Single Op Amp 2.7V to 6.0V Single Supply CMOS Source: http://ww1.microchip.com/downloads/en/DeviceDoc/21314g.pdf
IC12 IC14 = 74xx-eu:74*138: 3-line to 8-line DECODER/DEMULTIPLEXER
IC17 = 74xx-us:74*08: Quad 2-input AND gate
LED2 = led-7-segment:LA-401*D: Single Digit LED Numeric Display (anode common) Source: ROHM .. la-1401dn.pdf; OC_FARNELL: unknown; OC_NEWARK: unknown
LED-CLK-IN LED-CV-OUT LED-EXTERNAL LED-FREQ-CV LED-INT+EXT LED-INT-OSC LED-INTERNAL LED-Q1-LED-Q3 LED-RESET LED-S1-LED-S8 LED-X1-LED-X3 LED_GATE_OUT = led:TLLG4400: Low Current (2mA) LED 3 mm Tinted Diffused Package color GREEN Source: Data sheet <http://www.farnell.com/datasheets/391098.pdf>; MF: VISHAY SEMICONDUCTOR; OC_FARNELL: 1612435
Q4 = transistor-pnp:2N3906: PNP Transistor
Q5 = transistor-npn:2N3904: NPN Transistor
Q6 Q14-Q20 = transistor-small-signal:J310: N-Channel RF Amplifier J309, J310 Source: http://www.fairchildsemi.com/pf/J3/J310.html
R1-R23 R26 R27 R30-R37 R50-R56 R65 R67-R69 = rcl:R-US_: RESISTOR, American symbol
R28 R29 R38-R49 R57-R64 R66 = resistor:R-US_: RESISTOR, American symbol
S9 = switch:55?: PUSHBUTTON SERIES 5500 SWITCHES Source: www.e-switch.com .. 5500.pdf
S10 = switch:50-2POLE30: SERIES 50 Single-Deck Rotary Switches two pole 30° Source: www.grayhill.com .. J-15-21.pdf
U$1-U$9 U$11-U$27 = !synth_sch:DIODE-0204/5
U$10 = !synth_sch:EURORACK-POWER